# Altium schematic sheet IO.SchDoc
size A4; SheetNumber: 7; SheetTotal: 8
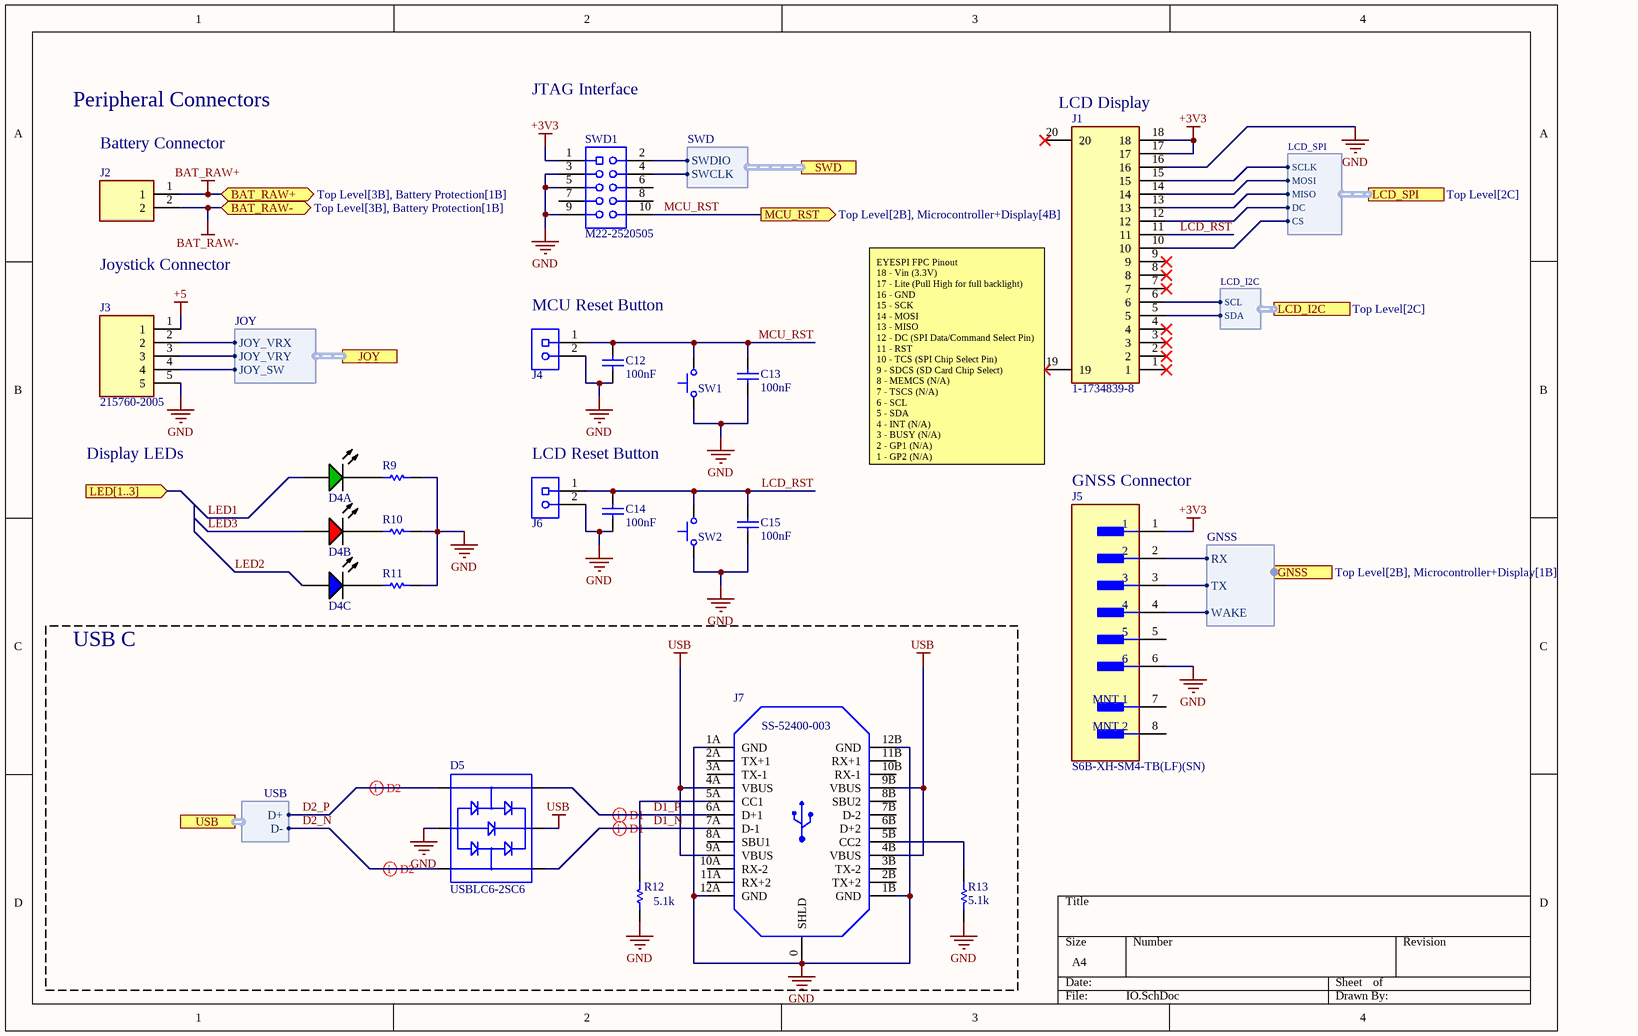
[diagram p0: IO.SchDoc]

## Parts
C12  value 100nF  [CAPC1608X10N]  (hidden comment: C0603C104M5RACTU)
C13  value 100nF  [CAPC1608X10N]  (hidden comment: C0603C104M5RACTU)
C14  value 100nF  [CAPC1608X10N]  (hidden comment: C0603C104M5RACTU)
C15  value 100nF  [CAPC1608X10N]  (hidden comment: C0603C104M5RACTU)
D4  LRTBGVSR-U4V2-JW+A6BB-D8+S2U2-7Z-20-S  [LRTBGVSG-UEVE-24+AMAQ-29+SCUC-HR-Footprint-1]  (value not drawn)  (parts A,B,C of 3)
D5  USBLC6-2SC6  [USBLC6-2SC6]
J1  1-1734839-8  [117348398]
J2  S2B-PH-K-S__LF__SN_  [SHDRRA2W50P0X200_1X2_590X760X480P]  (value not drawn)
J3  215760-2005  [215760-YY05]
J4  22-28-4020  [22-28-4020]  (value not drawn)
J5  S6B-XH-SM4-TB(LF)(SN)  [FP-S6B-XH-SM4-TB_LF_SN-MFG]
J6  22-28-4020  [22-28-4020]  (value not drawn)
J7  SS-52400-003  [SS52400005]
R9  CRCW06031K00FKEA  [0603]  (value not drawn)
R10  CRCW06031K00FKEA  [0603]  (value not drawn)
R11  CRCW06031K00FKEA  [0603]  (value not drawn)
R12  value 5.1k  [0603]  (hidden comment: CRCW06035K10FKEA)
R13  value 5.1k  [0603]  (hidden comment: CRCW06035K10FKEA)
SW1  B3U-1000P  [B3U-1000P]  (value not drawn)
SW2  B3U-1000P  [B3U-1000P]  (value not drawn)
SWD1  M22-2520505  [M22-2520505]

## Blocks framed on the sheet
USB C: D5 J7 R12 R13

## Ports
BAT_RAW+ (bidir, see Top Level[3B], Battery Protection[1B]), BAT_RAW- (bidir, see Top Level[3B], Battery Protection[1B]), GNSS (harness GNSS, see Top Level[2B], Microcontroller+Display[1B]), JOY (harness JOY, see Top Level[2C], Microcontroller+Display[2D]), LCD_I2C (harness LCD_I2C, see Top Level[2C]), LCD_SPI (harness LCD_SPI, see Top Level[2C]), LED[1..3] (in, see Top Level[2B], Microcontroller+Display[3A]), MCU_RST (out, see Top Level[2B], Microcontroller+Display[4B]), SWD (harness SWD, see Top Level[2B], Microcontroller+Display[1C]), USB (harness USB, see Top Level[2C], Microcontroller+Display[1B])

## Harnesses
USB: D+, D-
JOY: JOY_VRX, JOY_VRY, JOY_SW
LCD_SPI: SCLK, MOSI, MISO, DC, CS
LCD_I2C: SCL, SDA
SWD: SWDIO, SWCLK
GNSS: TX, RX, WAKE

## Nets
+3V3: J1.17 J1.18 J5.1 SWD1.1(VDD)
+5: J3.1
BAT_RAW+: J2.1 ; port BAT_RAW+
BAT_RAW-: J2.2 ; port BAT_RAW-
GND: C12.1 C13.1 C14.1 C15.1 D5.2 J1.16 J3.5 J4.2 J5.6 J6.2 J7.0(SHLD) J7.1A(GND) J7.1B(GND) J7.12A(GND) J7.12B(GND) R9.2 R10.2 R11.2 R12.1 R13.1 SW1.1 SW2.1 SWD1.3(GND) SWD1.5(GND) SWD1.9(GND)
USB: D5.5 J7.4A(VBUS) J7.4B(VBUS) J7.9A(VBUS) J7.9B(VBUS)
D1_N: D5.6 J7.7A(D-1)
D1_P: D5.4 J7.6A(D+1)
D2_N: D5.1 ; port USB.D-
D2_P: D5.3 ; port USB.D+
LCD_RST: C14.2 C15.2 J1.11 J6.1 SW2.2
LED1: D4.6(A1)
LED2: D4.2(A3)
LED3: D4.5(A2)
MCU_RST: C12.2 C13.2 J4.1 SW1.2 SWD1.10(NRST) ; port MCU_RST
NetD4_1: D4.1(K1) R9.1
NetD4_3: D4.3(K3) R11.1
NetD4_4: D4.4(K2) R10.1
NetJ1_5: J1.5 ; port LCD_I2C.SDA
NetJ1_6: J1.6 ; port LCD_I2C.SCL
NetJ1_10: J1.10 ; port LCD_SPI.CS
NetJ1_12: J1.12 ; port LCD_SPI.DC
NetJ1_13: J1.13 ; port LCD_SPI.MISO
NetJ1_14: J1.14 ; port LCD_SPI.MOSI
NetJ1_15: J1.15 ; port LCD_SPI.SCLK
NetJ3_2: J3.2 ; port JOY.JOY_VRX
NetJ3_3: J3.3 ; port JOY.JOY_VRY
NetJ3_4: J3.4 ; port JOY.JOY_SW
NetJ5_2: J5.2 ; port GNSS.RX
NetJ5_3: J5.3 ; port GNSS.TX
NetJ5_4: J5.4 ; port GNSS.WAKE
NetJ7_5A: J7.5A(CC1) R12.2
NetJ7_5B: J7.5B(CC2) R13.2
NetSWD1_2: SWD1.2(SWDIO) ; port SWD.SWDIO
NetSWD1_4: SWD1.4(SWCLK) ; port SWD.SWCLK

Not connected (* = marked no-connect by the designer): J1 1* 2* 3* 4* 7* 8* 9* 19* 20*; J5 5 7(MNT_1) 8(MNT_2); J7 2A(TX+1) 2B(TX+2) 3A(TX-1) 3B(TX-2) 6B(D+2) 7B(D-2) 8A(SBU1) 8B(SBU2) 10A(RX-2) 10B(RX-1) 11A(RX+2) 11B(RX+1); SWD1 6(SWO) 7(NC) 8(NC)

## Layout directives
differential pair: D1_N, D1_P, D2_N, D2_P

## Notes on the sheet
- Peripheral Connectors
- JTAG Interface
- (near J1) LCD Display
- (near J2) Battery Connector
- Joystick Connector
- MCU Reset Button
- Display LEDs
- LCD Reset Button
- (near J1) EYESPI FPC Pinout
  18 - Vin (3.3V)
  17 - Lite (Pull High for full backlight)
  16 - GND
  15 - SCK
  14 - MOSI
  13 - MISO
  12 - DC (SPI Data/Command Select Pin)
  11 - RST
  10 - TCS (SPI Chip Select Pin)
  9 - SDCS (SD Card Chip Select)
  8 - MEMCS (N/A)
  7 - TSCS (N/A)
  6 - SCL
  5 - SDA
  4 - INT (N/A)
  3 - BUSY (N/A)
  2 - GP1 (N/A)
  1 - GP2 (N/A)
- (near J5) GNSS Connector

## Library data of the parts
C12-C15 = C0603C104M5RACTU: Cap Ceramic 0.1uF 50V X7R 20% SMD 0603 125C T/R; Dissipation Factor: 2.5%; Min Operating Temperature: -55°C; Contact Plating: Tin,Matte; Height: 0.8mm; Voltage Rating: 50V; REACH SVHC: No SVHC; Max Operating Temperature: 125°C; Termination: SMD/SMT; Package Quantity: 1; Capacitance: 100nF; Packaging: Tape and Reel; Width: 0.031inch; Depth: 0.8mm; Dielectric: X7R; Tolerance: 20%; Lead Pitch: 0.7mm; Thickness: 0.034inch; Length: 1.6mm; Dielectric Material: Ceramic; Radiation Hardening: No; Voltage Rating (DC): 50V; Case/Package: 0603; Case Code (Metric): 1608; Mount: Surface Mount,PCB; Case Code (Imperial): 0603; JLC_PN: C14663
D4 = LRTBGVSR-U4V2-JW+A6BB-D8+S2U2-7Z-20-S: LED Multicolor Red/True Green/Blue 626nm/528nm/465nm 40mA/50mA/50mA 6-Pin SMD T/R
D5 = USBLC6-2SC6: ESD Suppressors / TVS Diodes ESD Protection Low Cap
J1 = 1-1734839-8: Connector; Manufacturer_Name: TE Connectivity; Description: AMP - TE CONNECTIVITY - 1-1734839-8 - CONNECTOR; Datasheet Link: https://www.te.com/commerce/DocumentDelivery/DDEController?Action=showdoc&DocId=Customer+Drawing%7F1734839%7FC%7Fpdf%7FEnglish%7FENG_CD_1734839_C_C_1734839.pdf%7F1-1734839-8; Height: 2.05mm; Manufacturer_Part_Number: 1-1734839-8; Mouser Part Number: 571-1-1734839-8; Mouser Price/Stock: https://www.mouser.co.uk/ProductDetail/TE-Connectivity/1-1734839-8?qs=sXy4Dx%2FMQpOw5EO3e3m3KA%3D%3D; Arrow Part Number: 1-1734839-8; Arrow Price/Stock: https://www.arrow.com/en/products/1-1734839-8/te-connectivity
J2 = S2B-PH-K-S__LF__SN_: Connector; Manufacturer_Name: JST (JAPAN SOLDERLESS TERMINALS); Manufacturer_Part_Number: S2B-PH-K-S (LF)(SN); Datasheet Link: http://www.jst-mfg.com/product/pdf/eng/ePH.pdf; Height: 4.8mm
J3 = 215760-2005: Connector; Manufacturer_Name: Molex; Datasheet Link: https://www.molex.com/pdm_docs/sd/2157601002_sd.pdf; Height: 5.87mm; Manufacturer_Part_Number: 215760-2005; Mouser Part Number: 538-215760-2005; Mouser Price/Stock: https://www.mouser.co.uk/ProductDetail/Molex/215760-2005?qs=pBJMDPsKWf1lOu66Lw3MIg%3D%3D
J4 J6 = 22-28-4020: KK 254 Breakaway Header, Vertical, 2 Circuits, Tin (Sn) Plating, Mating Pin Length 6.09mm 2 POS; Number of Positions: 2; Voltage Rating (DC): 250V; Contact Resistance: 20mR; Gender: Male; Connector Type: Male Pin; Glow Wire Compliant: Non-compliant; Pitch: 2.54mm; Current Rating: 4A; Orientation: Straight; Flammability Rating: UL94 V-0; Termination: Solder; Mount: Through Hole; Housing Color: Black; Contact Mating Length: 0.24inch; Min Operating Temperature: 0°C; Package Quantity: 1; Color: Black; Voltage Rating: 250V; REACH SVHC: Unknown; Contact Plating: Tin; Packaging: Bulk; Max Voltage Rating (DC): 250V; Max Operating Temperature: 75°C; Number of Circuits: 2; Housing Material: Nylon; Number of Contacts: 2; Lead Free: Lead Free; Radiation Hardening: No; Number of Rows: 1; Contact Material: Brass,Bronze; Mounting Technology: Through Hole; Depth: 2.49mm; Max Voltage Rating (AC): 250V; Series: KK® 42375; Contact Type: Male Pin
J5 = S6B-XH-SM4-TB(LF)(SN): CONN HEADER SMD R/A 6POS 2.5MM; Gender: Male; Number of Positions: 6; Max Current Rating: 3A; Voltage Rating: 250V; Contact Resistance: 20mR; Flammability Rating: UL94 V-0; Orientation: Right Angle; Contact Finish - Mating: TIN; Packaging: Tape and Reel; Termination: Solder; Pitch: 2.5mm; Housing Color: Beige; Insulation Material: Nylon; Fastening Type: Detent; Housing Material: Polyamide; Package Quantity: 1; Mount: Surface Mount; Insulation Color: Natural; Series: XH; Depth: 7mm; Contact Shape: Square; Color: Natural; Max Voltage Rating (AC): 250V; Min Operating Temperature: -25°C; Number of Contacts: 6; Lead Free: Lead Free; Contact Material: Copper Alloy; Contact Type: Male Pin; Length: 20mm; Max Operating Temperature: 85°C; Connector Type: Header; Number of Rows: 1; REACH SVHC: No SVHC; Contact Plating: Copper
J7 = SS-52400-003: USB Type-C Receptacle for 1.60mm PCB; Manufacturer_Name: BelFuse; Manufacturer_Part_Number: SS-52400-005; Datasheet Link: https://www.belfuse.com/resources/drawings/stewartconnector/dr-STW-SS-52400-005.pdf; Mouser Part Number: 530-SS-52400-005; Mouser Price/Stock: https://www.mouser.co.uk/ProductDetail/Stewart-Connector-Bel/SS-52400-005?qs=Wj%2FVkw3K%252BMC%2FVoWwkQ%252BKYA%3D%3D
R9-R11 = CRCW06031K00FKEA: VISHAY - CRCW06031K00FKEA - SMD Chip Resistor, 0603 [1608 Metric], 1 kohm, CRCW e3 Series, 75 V, Thick Film, 100 mW; Value: 5.1k
R12 R13 = CRCW06035K10FKEA: Res Thick Film 0603 5.1K Ohm 1% 1/10W ±100ppm/°C Molded SMD SMD Paper T/R
SW1 SW2 = B3U-1000P: SWITCH TACTILE SPST-NO 0.05A 12V; Actuator Length: 0.4mm; Contact Resistance: 100mR; Mechanical Life: 200000Cycles; Contact Current Rating: 50mA; Illumination Type: Non-Illuminated,Illuminated; Actuator Type: Standard; Ratings: Dust Proof,IP40; Switch Travel: 0.15mm; Throw Configuration: SPST; Operating Force: 1.5N; Switch Function: Off-Mom; Width: 3mm; REACH SVHC: Unknown; Max Voltage Rating (DC): 12V; Packaging: Tape and Reel; Mount: Surface Mount; Max Operating Temperature: 70°C; Min Operating Temperature: -25°C; Length: 4mm; Depth: 2.5mm; Termination: SMD/SMT; Contact Material: Silver; Weight: 0.000776oz; Current Rating: 50mA; Package Quantity: 1; Max Current Rating: 50mA; Lead Free: Lead Free; Voltage Rating (DC): 12V; Electrical Life: 200000Cycles; Insulation Resistance: 100MR; Orientation: Straight; Height: 1.2mm